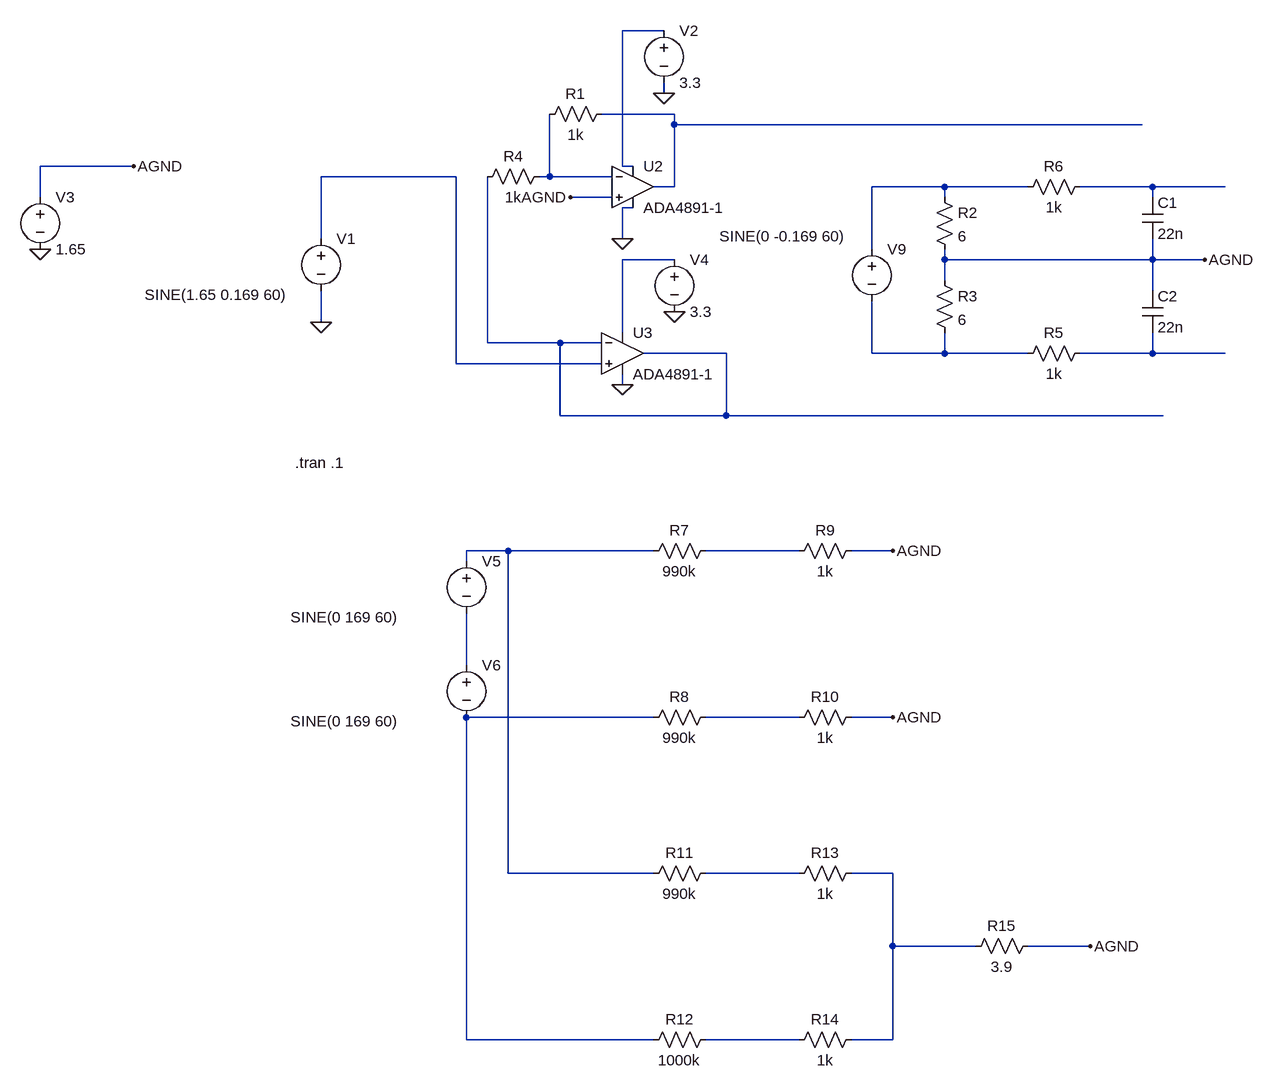
[diagram p0: schematic OP_Buffer_CT_Full.asc]
OP_Buffer_CT_Full.asc, the LTspice schematic file:
Version 4
SHEET 1 1864 1388
WIRE 608 -224 544 -224
WIRE 608 -128 608 -144
WIRE 624 -96 512 -96
WIRE 624 -80 624 -96
WIRE 1344 -80 624 -80
WIRE -208 -16 -352 -16
WIRE 544 -16 544 -224
WIRE 560 -16 544 -16
WIRE 288 0 80 0
WIRE 432 0 432 -96
WIRE 432 0 416 0
WIRE 528 0 432 0
WIRE 624 16 624 -80
WIRE 624 16 592 16
WIRE 1040 16 928 16
WIRE 1168 16 1040 16
WIRE 1360 16 1248 16
WIRE 1472 16 1360 16
WIRE -352 32 -352 -16
WIRE 528 32 464 32
WIRE 1040 32 1040 16
WIRE 1360 32 1360 16
WIRE 560 48 544 48
WIRE 80 96 80 0
WIRE 544 96 544 48
WIRE 928 112 928 16
WIRE 624 128 544 128
WIRE 1040 128 1040 112
WIRE 1360 128 1360 96
WIRE 1360 128 1040 128
WIRE 1440 128 1360 128
WIRE 1040 160 1040 128
WIRE 1360 176 1360 128
WIRE 80 224 80 176
WIRE 544 240 544 128
WIRE 336 256 336 0
WIRE 448 256 336 256
WIRE 512 256 448 256
WIRE 704 272 576 272
WIRE 928 272 928 192
WIRE 1040 272 1040 240
WIRE 1040 272 928 272
WIRE 1168 272 1040 272
WIRE 1360 272 1360 240
WIRE 1360 272 1248 272
WIRE 1472 272 1360 272
WIRE 288 288 288 0
WIRE 512 288 288 288
WIRE 544 320 544 304
WIRE 448 368 448 256
WIRE 704 368 704 272
WIRE 704 368 448 368
WIRE 1376 368 704 368
WIRE 368 576 304 576
WIRE 592 576 368 576
WIRE 816 576 672 576
WIRE 960 576 896 576
WIRE 304 592 304 576
WIRE 304 752 304 672
WIRE 592 832 304 832
WIRE 816 832 672 832
WIRE 960 832 896 832
WIRE 368 1072 368 576
WIRE 592 1072 368 1072
WIRE 816 1072 672 1072
WIRE 960 1072 896 1072
WIRE 960 1184 960 1072
WIRE 1088 1184 960 1184
WIRE 1264 1184 1168 1184
WIRE 304 1328 304 832
WIRE 592 1328 304 1328
WIRE 816 1328 672 1328
WIRE 960 1328 960 1184
WIRE 960 1328 896 1328
FLAG 80 224 0
FLAG 608 -128 0
FLAG 544 96 0
FLAG -352 112 0
FLAG -208 -16 AGND
FLAG 464 32 AGND
FLAG 544 320 0
FLAG 624 208 0
FLAG 1440 128 AGND
FLAG 960 576 AGND
FLAG 960 832 AGND
FLAG 1264 1184 AGND
SYMBOL voltage 80 80 R0
WINDOW 123 0 0 Left 0
WINDOW 39 0 0 Left 0
WINDOW 3 -271 102 Left 2
SYMATTR Value SINE(1.65 0.169 60)
SYMATTR InstName V1
SYMBOL res 320 16 R270
WINDOW 0 32 56 VTop 2
WINDOW 3 0 56 VBottom 2
SYMATTR InstName R4
SYMATTR Value 1k
SYMBOL voltage 608 -240 R0
WINDOW 123 0 0 Left 0
WINDOW 39 0 0 Left 0
SYMATTR InstName V2
SYMATTR Value 3.3
SYMBOL res 416 -80 R270
WINDOW 0 32 56 VTop 2
WINDOW 3 0 56 VBottom 2
SYMATTR InstName R1
SYMATTR Value 1k
SYMBOL OpAmps\\ADA4891-1 560 -48 R0
SYMATTR InstName U2
SYMBOL OpAmps\\ADA4891-1 544 208 R0
SYMATTR InstName U3
SYMBOL voltage -352 16 R0
WINDOW 123 0 0 Left 0
WINDOW 39 0 0 Left 0
SYMATTR InstName V3
SYMATTR Value 1.65
SYMBOL voltage 624 112 R0
WINDOW 123 0 0 Left 0
WINDOW 39 0 0 Left 0
SYMATTR InstName V4
SYMATTR Value 3.3
SYMBOL res 1024 16 R0
SYMATTR InstName R2
SYMATTR Value 6
SYMBOL res 1024 144 R0
SYMATTR InstName R3
SYMATTR Value 6
SYMBOL res 1264 256 R90
WINDOW 0 0 56 VBottom 2
WINDOW 3 32 56 VTop 2
SYMATTR InstName R5
SYMATTR Value 1k
SYMBOL res 1264 0 R90
WINDOW 0 0 56 VBottom 2
WINDOW 3 32 56 VTop 2
SYMATTR InstName R6
SYMATTR Value 1k
SYMBOL cap 1344 32 R0
SYMATTR InstName C1
SYMATTR Value 22n
SYMBOL cap 1344 176 R0
SYMATTR InstName C2
SYMATTR Value 22n
SYMBOL voltage 304 576 R0
WINDOW 123 0 0 Left 0
WINDOW 39 0 0 Left 0
WINDOW 3 -271 102 Left 2
SYMATTR Value SINE(0 169 60)
SYMATTR InstName V5
SYMBOL voltage 304 736 R0
WINDOW 123 0 0 Left 0
WINDOW 39 0 0 Left 0
WINDOW 3 -271 102 Left 2
SYMATTR Value SINE(0 169 60)
SYMATTR InstName V6
SYMBOL res 576 592 R270
WINDOW 0 32 56 VTop 2
WINDOW 3 0 56 VBottom 2
SYMATTR InstName R7
SYMATTR Value 990k
SYMBOL res 576 848 R270
WINDOW 0 32 56 VTop 2
WINDOW 3 0 56 VBottom 2
SYMATTR InstName R8
SYMATTR Value 990k
SYMBOL res 800 592 R270
WINDOW 0 32 56 VTop 2
WINDOW 3 0 56 VBottom 2
SYMATTR InstName R9
SYMATTR Value 1k
SYMBOL res 800 848 R270
WINDOW 0 32 56 VTop 2
WINDOW 3 0 56 VBottom 2
SYMATTR InstName R10
SYMATTR Value 1k
SYMBOL voltage 928 96 R0
WINDOW 123 0 0 Left 0
WINDOW 39 0 0 Left 0
WINDOW 3 -235 -4 Left 2
SYMATTR Value SINE(0 -0.169 60)
SYMATTR InstName V9
SYMBOL res 576 1088 R270
WINDOW 0 32 56 VTop 2
WINDOW 3 0 56 VBottom 2
SYMATTR InstName R11
SYMATTR Value 990k
SYMBOL res 576 1344 R270
WINDOW 0 32 56 VTop 2
WINDOW 3 0 56 VBottom 2
SYMATTR InstName R12
SYMATTR Value 1000k
SYMBOL res 800 1088 R270
WINDOW 0 32 56 VTop 2
WINDOW 3 0 56 VBottom 2
SYMATTR InstName R13
SYMATTR Value 1k
SYMBOL res 800 1344 R270
WINDOW 0 32 56 VTop 2
WINDOW 3 0 56 VBottom 2
SYMATTR InstName R14
SYMATTR Value 1k
SYMBOL res 1184 1168 R90
WINDOW 0 0 56 VBottom 2
WINDOW 3 32 56 VTop 2
SYMATTR InstName R15
SYMATTR Value 3.9
TEXT 40 440 Left 2 !.tran .1

The netlist it stands for:
* OP_Buffer_CT_Full.asc
V1 N003 0 SINE(1.65 0.169 60)
R4 N008 N004 1k
V2 N001 0 3.3
R1 N004 N002 1k
XU2 AGND N004 N001 0 N002 ADA4891-1  ; pins In+ In- V+ V- OUT
XU3 N003 N008 N007 0 N008 ADA4891-1  ; pins In+ In- V+ V- OUT
V3 AGND 0 1.65
V4 N007 0 3.3
R2 N005 AGND 6
R3 AGND N009 6
R5 N010 N009 1k
R6 N006 N005 1k
C1 N006 AGND 22n
C2 AGND N010 22n
V5 N011 N013 SINE(0 169 60)
V6 N013 N014 SINE(0 169 60)
R7 N011 N012 990k
R8 N014 N015 990k
R9 N012 AGND 1k
R10 N015 AGND 1k
V9 N005 N009 SINE(0 -0.169 60)
R11 N011 N016 990k
R12 N014 N018 1000k
R13 N016 N017 1k
R14 N018 N017 1k
R15 AGND N017 3.9
.tran .1
.backanno
.end